# Altium schematic sheet LCD_LED_Controls.SchDoc
size A4; SheetNumber: 4; SheetTotal: 6
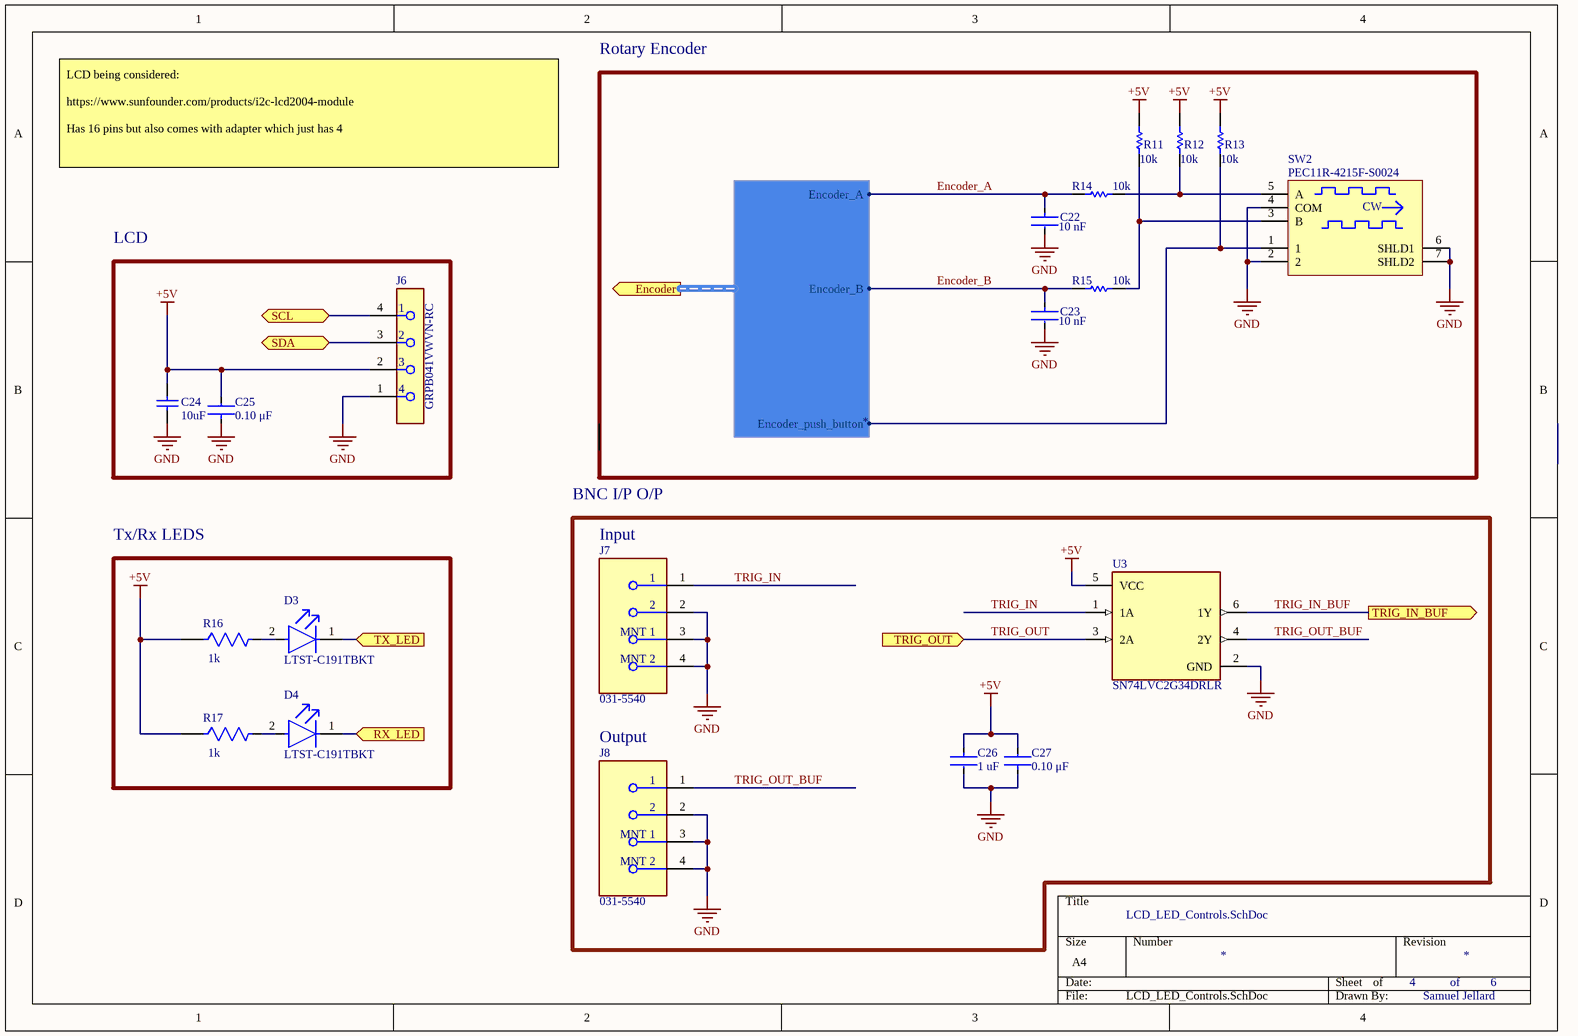
[diagram p0: LCD_LED_Controls.SchDoc]

## Parts
C22  value 10 nF  [FP-CC0603-DA-MFG]  (hidden comment: CC0603KRX7R8BB103)
C23  value 10 nF  [FP-CC0603-DA-MFG]  (hidden comment: CC0603KRX7R8BB103)
C24  value 10uF  [CAPC0603(1608)100_N]  (hidden comment: C0603C106M9PACTU)
C25  value 0.10 μF  [FP-C0603C-CF-MFG]  (hidden comment: C0603C104K5RACTU)
C26  value 1 uF  [FP-CC0603-DA-MFG]  (hidden comment: CC0603KRX7R7BB105)
C27  value 0.10 μF  [FP-C0603C-CF-MFG]  (hidden comment: C0603C104K5RACTU)
D3  LTST-C191TBKT  [FP-LTST-C191TBKT-MFG]
D4  LTST-C191TBKT  [FP-LTST-C191TBKT-MFG]
J6  GRPB041VWVN-RC  [LCD2004]
J7  031-5540  [FP-031-5540-MFG]
J8  031-5540  [FP-031-5540-MFG]
R11  CRCW060310K0FKEA  [RESC1609X50X30NL8T20]  (value not drawn)
R12  CRCW060310K0FKEA  [RESC1609X50X30NL8T20]  (value not drawn)
R13  CRCW060310K0FKEA  [RESC1609X50X30NL8T20]  (value not drawn)
R14  CRCW060310K0FKEA  [RESC1609X50X30NL8T20]  (value not drawn)
R15  CRCW060310K0FKEA  [RESC1609X50X30NL8T20]  (value not drawn)
R16  Resistance: 1k  [FP-CRCW0603-e3-MFG]  (hidden comment: CRCW06031K00FKEA)
R17  Resistance: 1k  [FP-CRCW0603-e3-MFG]  (hidden comment: CRCW06031K00FKEA)
SW2  PEC11R-4215F-S0024  [BOUR-PEC11R-4XXXF-SXXXX_V]
U3  SN74LVC2G34DRLR  [FP-DRL0006A-MFG]

## Blocks framed on the sheet
Rotary Encoder: C22 C23 R11-R15 SW2
LCD: C24 C25 J6
Tx/Rx LEDS: D3 D4 R16 R17

## Ports
Encoder (out, harness *), RX_LED (in), SCL (bidir), SDA (bidir), TRIG_IN_BUF (out), TRIG_OUT (in), TX_LED (in)

## Harnesses
*: Encoder_A, Encoder_B, Encoder_push_button

## Nets
+5V: C24.2 C25.2 C26.1 C27.2 J6.2 R11.2 R12.2 R13.2 R16.1 R17.1 U3.5(VCC)
GND: C22.2 C23.2 C24.1 C25.1 C26.2 C27.1 J6.1 J7.2 J7.3(MNT_1) J7.4(MNT_2) J8.2 J8.3(MNT_1) J8.4(MNT_2) SW2.2 SW2.4(COM) SW2.6(SHLD1) SW2.7(SHLD2) U3.2(GND)
Encoder_A: C22.1 R14.2 ; port Encoder.Encoder_A
Encoder_B: C23.1 R15.2 ; port Encoder.Encoder_B
RX_LED: D4.1(C) ; port RX_LED
SCL: J6.4 ; port SCL
SDA: J6.3 ; port SDA
TRIG_IN: J7.1 U3.1(1A)
TRIG_IN_BUF: U3.6(1Y) ; port TRIG_IN_BUF
TRIG_OUT: U3.3(2A) ; port TRIG_OUT
TRIG_OUT_BUF: J8.1 U3.4(2Y)
TX_LED: D3.1(C) ; port TX_LED
NetD3_2: D3.2(A) R16.2
NetD4_2: D4.2(A) R17.2
NetR11_1: R11.1 R15.1 SW2.3(B)
NetR12_1: R12.1 R14.1 SW2.5(A)
NetR13_1: R13.1 SW2.1 ; port Encoder.Encoder_push_button

## Notes on the sheet
- LCD being considered:
  https://www.sunfounder.com/products/i2c-lcd2004-module
  Has 16 pins but also comes with adapter which just has 4
- (near R11) 10k
- (near R12) 10k
- (near R13) 10k
- (near R14) 10k
- (near R15) 10k
- BNC I/P O/P
- (near J7) Input
- Output
- of
- Samuel Jellard
- (in symbol CMP-1747-00012-1) CW

## Library data of the parts
C22 C23 = CMP-03422-000327-1: Surface Mount Ceramic Multilayer Capacitor 0.01uF 10% X7R 25V 0603 Paper T/R; Manufacturer: YAGEO; Tolerance: 0.1; Temperature Coefficient: 15%; Lead Free: Yes; Material: Ceramic; Temperature Range Low: -55°C; Mouser Description: Multilayer Ceramic Capacitors MLCC - SMD/SMT 10nF 25V X7R 10%; Device Class L1: Passive Components; RoHS: TRUE; Digikey Description: CAP CER 10000PF 25V X7R 0603; Capacitance: 10 nF; Temperature: -55°C to +125°C; Footprint Url: http://www.yageo.com/exep/pages/download/literatures/UPY-C_GEN_24.pdf; Category: Cap; ComponentLink2URL: http://www.yageo.com/documents/recent/UPY-GPHC_X7R_6.3V-to-50V_18.pdf; Octopart: https://octopart.com/cc0603krx7r8bb103-yageo-9288195; Temperature Characteristic: X7R; ComponentLink2Description: Datasheet; Voltage Rating: 25 V; Package: CC0603-DA; Automotive: No; Voltage: 25 V; Device Class L3: Ceramic Capacitors; Manufacturer Part Number: CC0603KRX7R8BB103; Device Class L2: Capacitors; Temperature Range High: +125°C; Height: 0.9mm
C24 = CMP-1035-02797-1: CAP 10uF 6.3V ±20% 0603 (1608 Metric) Thickness 1mm SMD; Case-Metric: 1608; Case-EIA: 0603; Tolerance: Â±20%; Technology: SMT; Max Thickness: 1 mm; Rated Voltage: 6.3 V
C25 C27 = CMP-2006-03061-2: Multilayer Ceramic Capacitors (MLCC) - SMD/SMT 50volts 0.1uF X7R 10%; Manufacturer: KEMET; Tolerance: 0.1; Temperature Coefficient: 30ppm/°C; Automotive Grade: Grade 1; Voltage Rating: 50 V; Temperature: -55°C to +125°C; RoHS: TRUE; Material: Ceramic; Temperature Range High: +125°C; Lead Free: Yes; Octopart: https://octopart.com/c0603c104k5ractu-kemet-139244; Digikey Description: CAP CER 0.1UF 50V X7R 0603; Category: Cap; Package: C0603C-CF; ComponentLink2Description: Datasheet; Temperature Range Low: -55°C; Device Class L1: Passive Components; Automotive: Yes; Device Class L3: Ceramic Capacitors; ComponentLink2URL: https://api.kemet.com/component-edge/download/datasheet/C0603C100J5GACAUTO.pdf; Capacitance: 0.10 μF; Device Class L2: Capacitors; Manufacturer Part Number: C0603C104K5RACTU; Temperature Characteristic: X7R; Height: 0.87mm
C26 = CMP-03422-000924-1: 0603 1 uF 16 V ±10 % Tolerance X7R SMT Multilayer Ceramic Capacitor; Manufacturer: YAGEO; Tolerance: 0.1; Temperature Coefficient: 15%; Voltage: 16 V; Package: CC0603-DA; RoHS: TRUE; Device Class L2: Capacitors; Temperature Characteristic: X7R; Temperature: -55°C to +125°C; Temperature Range Low: -55°C; Automotive: No; ComponentLink2Description: Datasheet; Lead Free: Yes; Capacitance: 1 uF; ComponentLink2URL: http://www.yageo.com/documents/recent/UPY-GPHC_X7R_6.3V-to-50V_18.pdf; Device Class L1: Passive Components; Octopart: https://octopart.com/cc0603krx7r7bb105-yageo-42271928; Category: Cap; Digikey Description: CAP CER 1UF 16V X7R 0603; Footprint Url: http://www.yageo.com/exep/pages/download/literatures/UPY-C_GEN_24.pdf; Height: 0.9mm; Manufacturer Part Number: CC0603KRX7R7BB105; Material: Ceramic; Voltage Rating: 16 V; Temperature Range High: +125°C; Mouser Description: Multilayer Ceramic Capacitor, CC Series, 1 - F, - 10%, X7R, 16 V, 0603 [1608 Metric]; Device Class L3: Ceramic Capacitors
D3 D4 = CMP-22017-000008-1: LED Uni-Color Blue 468nm 2-Pin Chip LED T/R / LED BLUE CLEAR 0603 SMD; Lens Color: Colorless; Dominant Wavelength: 475nm; Forward Current: 20mA; Viewing Angle: 130°; Power Dissipation: 76mW; Luminous Intensity: 180mcd; Reverse Voltage: 5V; Number of Elements: 1; Lens Style: Diffused; Forward Voltage: 3.8V; Max Power Dissipation: 75mW; Case Code (Metric): 1608; Packaging: Tape and Reel; Case/Package: 0603; Depth: 1.6mm; Mount: Surface Mount; Lead Free: Lead Free; Wavelength: 468nm; Min Operating Temperature: -20°C; Lens Transparency: Clear; Illumination Color: Blue; Height: 0.55mm; Test Current: 20mA; Case Code (Imperial): 0603; Max Operating Temperature: 80°C; Number of Pins: 2; Length: 0.8mm; Radiation Hardening: No; Package Quantity: 1; Number of LEDs: 1; Width: 0.8mm; Color: Blue
J6 = 56792406a6bd5c25e158f553ecd1aa7: CONN HEADER VERT 4POS 1.27MM; Pitch: 0.05inch; Number of Positions: 4; Contact Type: Female Socket; Lead Free: Lead Free; Mount: Through Hole; RoHS Compliant: Yes; Package Quantity: 1; Termination: Solder; Contact Plating: Gold; Connector Type: Header; Number of Rows: 1; Packaging: Bulk
J7 J8 = CMP-20040-000002-1: CONN BNC RCPT R/A 50 OHM PCB; Manufacturer: Amphenol RF; Impedance: 50Ω; Number Of Contacts: 2; Pitch: 2.54mm; Dielectric Material: Polypropylene; Is Female: yes; Frequency: 1GHz; Conn Orientation: Right Angle; Lead Free: Yes; Device Class L2: RF / Coaxial Connectors; Digikey Description: CONN BNC RCPT R/A 50 OHM PCB; Octopart: https://octopart.com/031-5540-amphenol+rf-49742301; ComponentLink2URL: https://www.amphenolrf.com/downloads/dl/file/id/2040/product/579/031_5540_customer_drawing.pdf; Package: 0; Automotive: No; Temperature: -55°C to +85°C; Contact Material: Gold,Nickel; RoHS: TRUE; ComponentLink2Description: Datasheet; Height: 13.4mm; Category: Conn; Manufacturer Part Number: 031-5540; Temperature Range High: +85°C; Device Class L3: unset; Temperature Range Low: -55°C; Device Class L1: Connectors
R11-R15 = CMP-1666-00005-4: Chip Resistor, 10 KOhm, +/- 1%, 100 mW, -55 to 155 degC, 0603 (1608 Metric), RoHS, Tape and Reel; Manufacturer: Vishay Semiconductor; Voltage Rating: 75 V; Max Operating Temperature: 155 degC; PackageDescription: 2-Pin Surface Mount Device, Body 1.575 x 0.85 mm; ComponentLink1Description: Manufacturer URL; RoHSCompliant: true; PackageReference: 0603; REACH SVHC: Unknown; Length: 1.55 mm; DatasheetVersion: 06/2012; Packaging: Tape and Reel; Min Operating Temperature: -55 degC; Mounting Technology: Surface Mount; ComponentLink2URL: https://datasheet.ciiva.com/11809/0900766b80d98afc-11809037.pdf; Height: 0.45 mm; ComponentLink2Description: Datasheet; Package Quantity: 5000; ComponentLink1URL: http://www.vishay.com/
R16 R17 = CMP-1666-00003-5: RES Thick Film, 1kΩ, 1%, 0.1W, 100ppm/°C, 0603; Max Power Dissipation: 100mW; Voltage Rating: 75V; Max Operating Temperature: 155°C; Number of Pins: 2; Case Code (Imperial): 0603; Width: 0.033inch; Power Rating: 100mW; Number of Terminations: 2; Package Quantity: 10; Weight: 7.1E-05oz; Tolerance: 1%; Temperature Coefficient: 100ppm/°C; Military Standard: Not; Mount: Surface Mount; Voltage Rating (DC): 75V; Depth: 0.85mm; Composition: Thick Film; Radiation Hardening: No; Termination: SMD/SMT; Length: 1.55mm; Case Code (Metric): 1608; Contact Plating: Tin; Min Operating Temperature: -55°C; Packaging: Tape and Reel; Height: 0.45mm; Lead Free: Lead Free; Case/Package: 0603; Features: Automotive AEC-Q200
SW2 = CMP-1747-00012-1: 12 mm Incremental Encoder, 24 Detent, -30 to 70 degC, 5-Pin THD, RoHS, Bulk; Case\Package: Axial; Power Rating: 250 mW; Voltage Rating: 250 V; Tolerance: 1%; Resistance: 100 kohm; Mount: Through Hole; Package Quantity: 200; ComponentLink2Description: Datasheet; Max Operating Temperature: 155 degC; Length: 0.248 inch; Packaging: Bulk; ComponentLink2URL: http://www.bourns.com/docs/Product-Datasheets/PEC11R.pdf; Min Operating Temperature: -55 degC; DatasheetVersion: Jul-14; ComponentLink1Description: Manufacturer URL; RoHSCompliant: true; PackageDescription: 5-Pin Through Hole Device, Body 12.5 x 13.4 mm; PackageReference: PEC11R-4XXXF-SXXXX; ComponentLink1URL: http://www.bourns.com/
U3 = CMP-0859-00812-4: IC BUFFER NON-INVERT 5.5V 6SOT; Number of Bits per Element: 1; Number of Bits: 2; Low Level Output Current: 32mA; Polarity: Non-Inverting; Min Supply Voltage: 1.65V; Propagation Delay: 8.6ns; High Level Output Current: -32mA; Quiescent Current: 10uA; Contact Plating: Gold; Case/Package: SOT; Technology: CMOS; Min Operating Temperature: -40°C; Number of Elements: 2; REACH SVHC: No SVHC; Number of Channels: 2; Series: 74LVC; Number of Pins: 6; Mount: Surface Mount; Logic Function: Buffer; Number of Output Lines: 2; Packaging: Tape and Reel; Package Quantity: 4000; Radiation Hardening: No; Number of Gates: 2; Turn-On Delay Time: 8.6ns; Max Operating Temperature: 125°C; Max Supply Voltage: 5.5V; Lead Free: Lead Free; RoHS Compliant: Yes; Number of Outputs: 2; Number of Inputs: 2; Number of Input Lines: 2